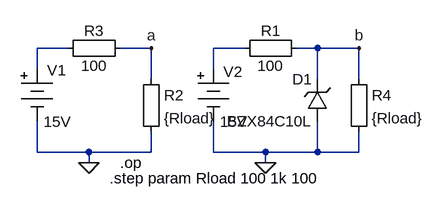
[diagram p0: schematic zener-var-load.asc]
zener-var-load.asc, the LTspice schematic file:
Version 4
SHEET 1 880 680
WIRE 112 -256 64 -256
WIRE 240 -256 192 -256
WIRE 384 -256 336 -256
WIRE 496 -256 464 -256
WIRE 560 -256 496 -256
WIRE 64 -224 64 -256
WIRE 336 -224 336 -256
WIRE 240 -208 240 -256
WIRE 496 -208 496 -256
WIRE 560 -208 560 -256
WIRE 64 -96 64 -144
WIRE 144 -96 64 -96
WIRE 240 -96 240 -128
WIRE 240 -96 144 -96
WIRE 336 -96 336 -144
WIRE 416 -96 336 -96
WIRE 496 -96 496 -144
WIRE 496 -96 416 -96
WIRE 560 -96 560 -128
WIRE 560 -96 496 -96
WIRE 144 -80 144 -96
WIRE 416 -80 416 -96
FLAG 144 -80 0
FLAG 240 -256 a
FLAG 416 -80 0
FLAG 560 -256 b
SYMBOL Misc\\battery 64 -240 R0
WINDOW 123 0 0 Left 2
WINDOW 39 0 0 Left 2
WINDOW 0 16 18 Left 2
WINDOW 3 10 97 Left 2
SYMATTR InstName V1
SYMATTR Value 15V
SYMBOL Misc\\EuropeanResistor 224 -224 R0
SYMATTR InstName R2
SYMATTR Value {Rload}
SYMBOL Misc\\battery 336 -240 R0
WINDOW 123 0 0 Left 2
WINDOW 39 0 0 Left 2
WINDOW 0 15 20 Left 2
WINDOW 3 10 97 Left 2
SYMATTR InstName V2
SYMATTR Value 15V
SYMBOL Misc\\EuropeanResistor 544 -224 R0
SYMATTR InstName R4
SYMATTR Value {Rload}
SYMBOL zener 512 -144 R180
WINDOW 0 24 64 Left 2
WINDOW 3 24 0 Left 2
SYMATTR InstName D1
SYMATTR Value BZX84C10L
SYMBOL Misc\\EuropeanResistor 480 -272 R90
WINDOW 0 5 56 VBottom 2
WINDOW 3 27 56 VTop 2
SYMATTR InstName R1
SYMATTR Value 100
SYMBOL Misc\\EuropeanResistor 208 -272 R90
WINDOW 0 5 56 VBottom 2
WINDOW 3 27 56 VTop 2
SYMATTR InstName R3
SYMATTR Value 100
TEXT 192 -80 Left 2 !.op
TEXT 176 -56 Left 2 !.step param Rload 100 1k 100

The netlist it stands for:
* zener-var-load.asc
V1 N001 0 15V
R2 a 0 {Rload}
V2 N002 0 15V
R4 b 0 {Rload}
D1 0 b BZX84C10L
R1 b N002 100
R3 a N001 100
.model D D
.lib standard.dio
.op
.step param Rload 100 1k 100
.backanno
.end